# Altium project TIDA-010954-RevB.PrjPcb (part 4 of 6)

## Sheet TIDA-010954-ACSwitch.SchDoc
size 431 x 279 mm; Date: Not shown in title block; ApprovedBy: Not shown in title block; CheckedBy: Not shown in title block; Author: Not shown in title block; CompanyName: Not shown in title block; Engineer: Not shown in title block; Organization: Not shown in title block; Address1: Not shown in title block; Address2: Not shown in title block; Address3: Not shown in title block; Address4: Not shown in title block; DocumentNumber: 2; Revision: Use project parameter SCH_Rev; SheetNumber: 3; SheetTotal: 9; PageSetup: Record=PageOptions|CenterHorizontal=True|CenterVertical=True|PrintScale=1.00|XCorrection=1.00|YCorrection=1.00|PrintKind=0|BorderSize=5000000|LeftOffset=0|BottomOffset=0|Orientation=2|PaperLength=1000|PaperWidth=1000|Scale=100|PaperSource=15|PrintQuality=600|MediaType=1|DitherType=10|PaperKind=Letter|PrintScaleMode=1; CurrentTime: Not shown in title block; CurrentDate: Not shown in title block; Time: Not shown in title block; DocumentFullPathAndName: Not shown in title block; DocumentName: Not shown in title block; ModifiedDate: 1/25/2022; ImagePath: Not shown in title block
Used 2 times, as channels Cycloconverter/S1, Cycloconverter/S2. Parts and nets are listed once, with the designators drawn on the sheet.
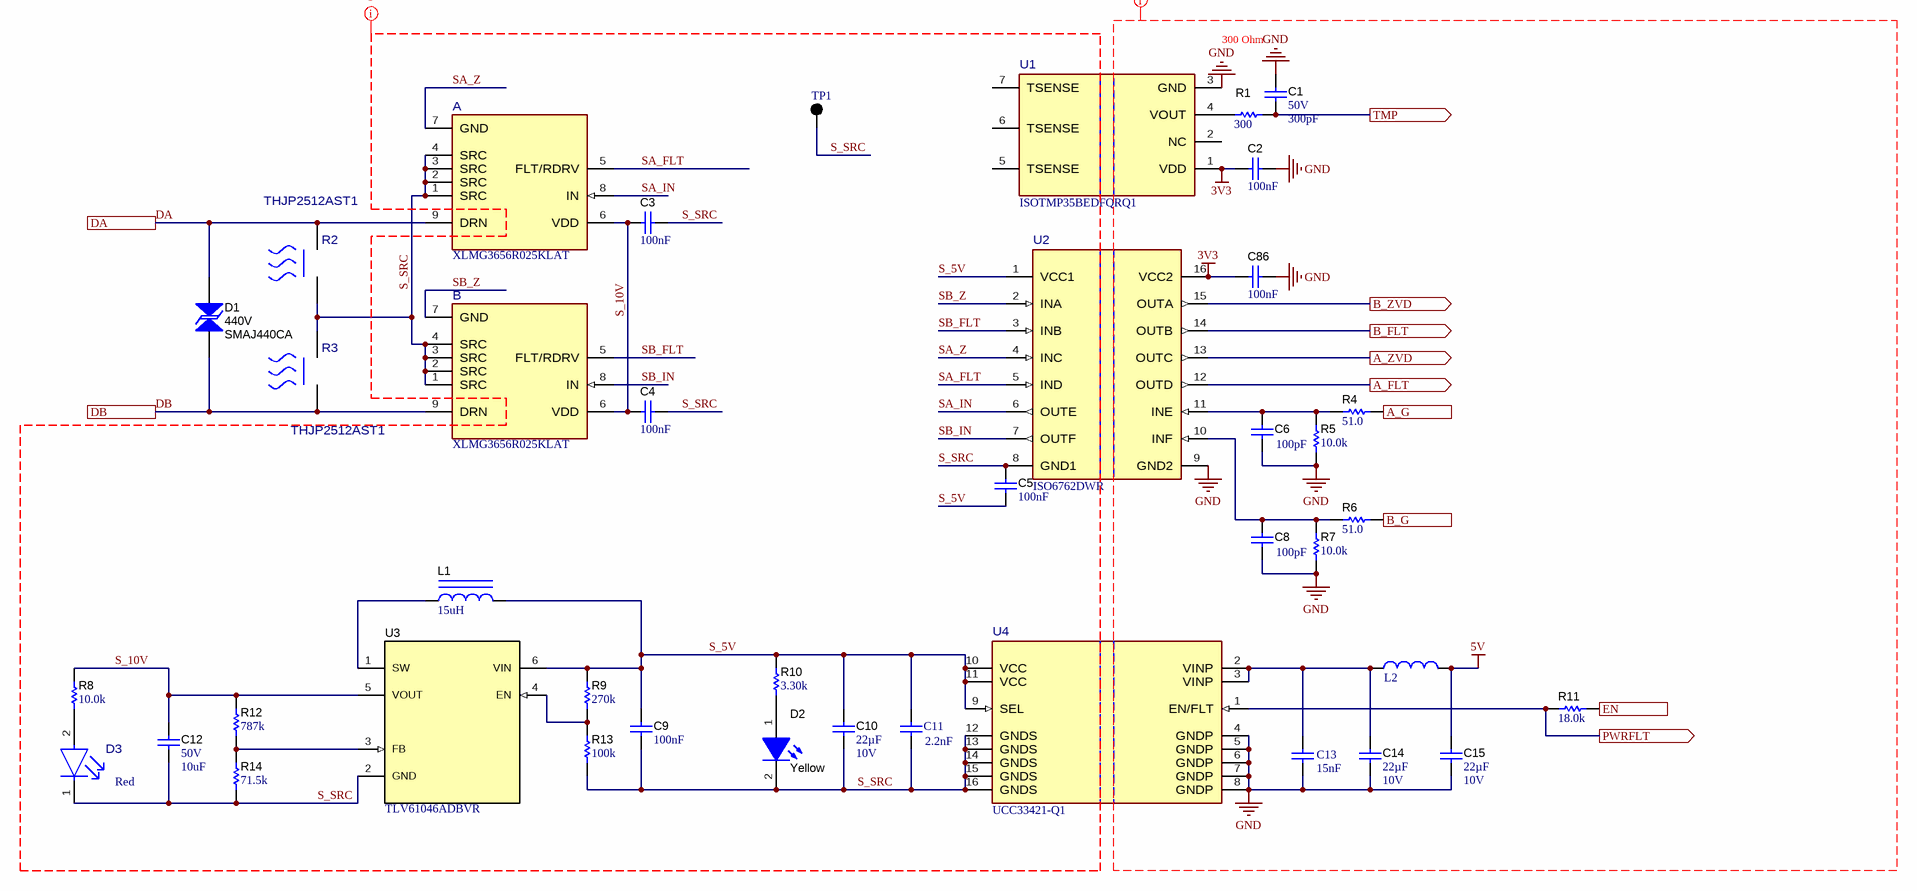
[diagram p5: TIDA-010954-ACSwitch.SchDoc]

### Parts
A  XLMG3656R025KLAT  [KLA0009A-MFG]
B  XLMG3656R025KLAT  [KLA0009A-MFG]
C1  VDC_V: 50V  ValueDisplayed: 300pF  [0603]  (hidden comment: GRM1885C1H301JA01D)
C2  Cap_F: 100nF  [0603]  (hidden comment: CGA3E2X7R1E104K080AA)
C3  Cap_F: 100nF  [0603]  (hidden comment: CGA3E2X7R1E104K080AA)
C4  Cap_F: 100nF  [0603]  (hidden comment: CGA3E2X7R1E104K080AA)
C5  Cap_F: 100nF  [0603]  (hidden comment: CGA3E2X7R1E104K080AA)
C6  ValueDisplayed: 100pF  [0603]  (hidden comment: GRM1885C1H101JA01D)
C8  ValueDisplayed: 100pF  [0603]  (hidden comment: GRM1885C1H101JA01D)
C9  Cap_F: 100nF  [0603]  (hidden comment: CGA3E2X7R1E104K080AA)
C10  Cap_F: 22µF  VDC_V: 10V  [0805_HV]  (hidden comment: GRM21BZ71A226ME15L)
C11  Cap_F: 2.2nF  [WCAP-CSGP_0402_L1W0.5H0.5]  (hidden comment: 885012205063)
C12  VDC_V: 50V  ValueDisplayed: 10uF  [1206_180]  (hidden comment: GRT31CR61H106KE01L)
C13  Cap_F: 15nF  [WCAP-CSGP_0402_L1W0.5H0.5]  (hidden comment: 885012205051)
C14  Cap_F: 22µF  VDC_V: 10V  [0805_HV]  (hidden comment: GRM21BZ71A226ME15L)
C15  Cap_F: 22µF  VDC_V: 10V  [0805_HV]  (hidden comment: GRM21BZ71A226ME15L)
C86  Cap_F: 100nF  [0603]  (hidden comment: CGA3E2X7R1E104K080AA)
D1  SMAJ440CA  value 440V  [SMA_Bi]
D2  value Yellow  [APT1608_Yellow]  (hidden comment: APT1608SYCK)
D3  Color: Red  [FP-APG1608SURKC_T_0603-MFG]  (hidden comment: APG1608SURKC/T)
L1  ValueDisplayed: 15uH  [SDR0302]  (hidden comment: SDR0302-150ML)
L2  74479763222  [WE-PMI_0603_L1.6W0.8H0.8]  (value not drawn)
R1  ValueDisplayed: 300  [0603]  (hidden comment: RC0603FR-07300RL)
R2  THJP2512AST1  [FP-THJP2512AST1_2512-MFG]
R3  THJP2512AST1  [FP-THJP2512AST1_2512-MFG]
R4  ValueDisplayed: 51.0  [0603]  (hidden comment: RC0603FR-0751RL)
R5  ValueDisplayed: 10.0k  [0603]  (hidden comment: RC0603FR-0710KL)
R6  ValueDisplayed: 51.0  [0603]  (hidden comment: RC0603FR-0751RL)
R7  ValueDisplayed: 10.0k  [0603]  (hidden comment: RC0603FR-0710KL)
R8  ValueDisplayed: 10.0k  [0603]  (hidden comment: RC0603FR-0710KL)
R9  ValueDisplayed: 270k  [0603]  (hidden comment: RC0603FR-07270KL)
R10  ValueDisplayed: 3.30k  [0603]  (hidden comment: RC0603FR-073K3L)
R11  ValueDisplayed: 18.0k  [0603]  (hidden comment: RC0603FR-0718KL)
R12  ValueDisplayed: 787k  [0603]  (hidden comment: RC0603FR-07787KL)
R13  ValueDisplayed: 100k  [0603]  (hidden comment: RC0603FR-07100KL)
R14  ValueDisplayed: 71.5k  [0603]  (hidden comment: RC0603FR-0771K5L)
TP1  5011  [Keystone5011]  (value not drawn)
U1  ISOTMP35BEDFQRQ1  [DFQ0007A-MFG]
U2  ISO6762DWR  [DW0016A-MFG]
U3  TLV61046ADBVR  [DBV0006A_N]
U4  UCC33421-Q1  [DWX0016A-MFG]

### Ports
A_FLT (out), A_G (in), A_ZVD (out), B_FLT (out), B_G (in), B_ZVD (out), DA, DB, EN (in), PWRFLT (out), TMP (out)

### Nets
3V3: C2.1 C86.1 U1.1(VDD) U2.16(VCC2)
5V: C15.1 L2.2
GND: C1.2 C2.2 C6.2 C8.2 C13.1 C14.2 C15.2 C86.2 R5.1 R7.1 U1.3(GND) U2.9(GND2) U4.4(GNDP) U4.5(GNDP) U4.6(GNDP) U4.7(GNDP) U4.8(GNDP)
A_FLT: U2.12(OUTD) ; port A_FLT
A_G: R4.2 ; port A_G
A_ZVD: U2.13(OUTC) ; port A_ZVD
B_FLT: U2.14(OUTB) ; port B_FLT
B_G: R6.2 ; port B_G
B_ZVD: U2.15(OUTA) ; port B_ZVD
DA: A.9(DRN) D1.2 R2.2 ; port DA
DB: B.9(DRN) D1.1 R3.1 ; port DB
EN: R11.2 ; port EN
PWRFLT: R11.1 U4.1(EN/FLT) ; port PWRFLT
S_5V: C5.1 C9.2 C10.1 C11.2 L1.2 R9.2 R10.2 U2.1(VCC1) U3.6(VIN) U4.9(SEL) U4.10(VCC) U4.11(VCC)
S_10V: A.6(VDD) B.6(VDD) C3.1 C4.1 C12.1 R8.2 R12.2 U3.5(VOUT)
S_SRC: A.1(SRC) A.2(SRC) A.3(SRC) A.4(SRC) B.1(SRC) B.2(SRC) B.3(SRC) B.4(SRC) C3.2 C4.2 C5.2 C9.1 C10.2 C11.1 C12.2 D2.2(K) D3.1(CATHODE) R2.1 R3.2 R13.1 R14.1 TP1.1 U2.8(GND1) U3.2(GND) U4.12(GNDS) U4.13(GNDS) U4.14(GNDS) U4.15(GNDS) U4.16(GNDS)
SA_FLT: A.5(FLT/RDRV) U2.5(IND)
SA_IN: A.8(IN) U2.6(OUTE)
SA_Z: A.7(GND) U2.4(INC)
SB_FLT: B.5(FLT/RDRV) U2.3(INB)
SB_IN: B.8(IN) U2.7(OUTF)
SB_Z: B.7(GND) U2.2(INA)
TMP: C1.1 R1.2 ; port TMP
NetC6_1: C6.1 R4.1 R5.2 U2.11(INE)
NetC8_1: C8.1 R6.1 R7.2 U2.10(INF)
NetC13_2: C13.2 C14.1 L2.1 U4.2(VINP) U4.3(VINP)
NetD2_1: D2.1(A) R10.1
NetD3_2: D3.2(ANODE) R8.1
NetL1_1: L1.1 U3.1(SW)
NetR1_1: R1.1 U1.4(VOUT)
NetR9_1: R9.1 R13.2 U3.4(EN)
NetR12_1: R12.1 R14.2 U3.3(FB)

Not connected (* = marked no-connect by the designer): U1 2(NC) 5(TSENSE) 6(TSENSE) 7(TSENSE)

### Channels
Cycloconverter/S1: designators A=S1A B=S1B C1=S1C1 C2=S1C2 C3=S1C3 C4=S1C4 C5=S1C5 C6=S1C6 C8=S1C8 C9=S1C9 C10=S1C10 C11=S1C11 C12=S1C12 C13=S1C13 C14=S1C14 C15=S1C15 C86=S1C86 D1=S1D1 D2=S1D2 D3=S1D3 L1=S1L1 L2=S1L2 R1=S1R1 R2=S1R2 R3=S1R3 R4=S1R4 R5=S1R5 R6=S1R6 R7=S1R7 R8=S1R8 R9=S1R9 R10=S1R10 R11=S1R11 R12=S1R12 R13=S1R13 R14=S1R14 TP1=S1TP1 U1=S1U1 U2=S1U2 U3=S1U3 U4=S1U4; ports A_FLT=S1A_FLT A_G=S1A_G A_ZVD=S1A_ZVD B_FLT=S1B_FLT B_G=S1B_G B_ZVD=S1B_ZVD DA=DA DB=DA EN=S_PWR PWRFLT=S1_PWR_FLT TMP=S1_TMP
Cycloconverter/S2: designators A=S2A B=S2B C1=S2C1 C2=S2C2 C3=S2C3 C4=S2C4 C5=S2C5 C6=S2C6 C8=S2C8 C9=S2C9 C10=S2C10 C11=S2C11 C12=S2C12 C13=S2C13 C14=S2C14 C15=S2C15 C86=S2C86 D1=S2D1 D2=S2D2 D3=S2D3 L1=S2L1 L2=S2L2 R1=S2R1 R2=S2R2 R3=S2R3 R4=S2R4 R5=S2R5 R6=S2R6 R7=S2R7 R8=S2R8 R9=S2R9 R10=S2R10 R11=S2R11 R12=S2R12 R13=S2R13 R14=S2R14 TP1=S2TP1 U1=S2U1 U2=S2U2 U3=S2U3 U4=S2U4; ports A_FLT=S2A_FLT A_G=S2A_G A_ZVD=S2A_ZVD B_FLT=S2B_FLT B_G=S2B_G B_ZVD=S2B_ZVD DA=DA DB=DB EN=S_PWR PWRFLT=S2_PWR_FLT TMP=S2_TMP

### Layout directives
net class SW_SRC: S_5V, S_10V, S_SRC, SA_FLT, SA_IN, SA_Z, SB_FLT, SB_IN, SB_Z
net class LV: 3V3, 5V, GND

### Notes on the sheet
- 300 Ohm
- Drawn By:
- SVN Rev:
- Number:
- TID #:
- Orderable:
- Rev:
- Sheet Title:
- File:
- Project Title:
- Designed for:
- Assembly Variant:
- Mod. Date:
- Sheet:
- Size:
- of
- B
- http://www.ti.com
- Texas Instruments and/or its licensors do not warrant the accuracy or completeness of this specification or any information contained therein. Texas Instruments and/or its licensors do not warrant that this design will meet the specifications, will be suitable for your application or fit for any particular purpose, or will operate in an implementation. Texas Instruments and/or its licensors do not warrant that the design is production worthy. You should completely validate and test your design implementation to confirm the system functionality for your application.
- Engineer:
- Contact:
- © Texas Instruments

### Library data of the parts
A B = CMP-0120607-2: Manufacturer: Texas Instruments; Part Number: LMG365x; SizeZ_mm: 2.35mm; AEC Qualified: No; Standoff Height: 0.1mm; AEC Category: Q200; CompType: IC; PackageReference: TO-9; PartNumber: XLMG3656R025KLAT; RoHS: UNKNOWN; Operating Temperature Range: to; Datasheet Path: datasheets/IC-LMG365x.pdf; helpURL: https://upverter.com/upn/revision/1f595fc64584fe9f/; ComponentLink1Description: Datasheet Link; ComponentLink1URL: http://www.ti.com/lit/ds/symlink/GPN.pdf; ComponentLink2Description: Product Folder; ComponentLink2URL: http://www.ti.com/product/GPN; ComponentLink3Description: Online Datasheet; ComponentLink3URL: http://www.ti.com/product/GPN/datasheet
C1 = CMP-0007206-4: as C16 on sheet TIDA-010954-Cycloconverter; Supplier Part Number 2: 81-GRM185C1H301JA01D; Publisher: Texas Instruments; Supplier 2: Mouser; TempCo: C0G/NP0; Published: 2008-06-19; RoHS: Y; MountType: SMT; Supplier 1: Digi-Key; PackageReference: 0603; Tolerance_%: 5%; Cap_Case: 0603; Value2: 50V; CompType: Capacitor; LatestRevisionDate: 2017-03-09; PartNumber: GRM1885C1H301JA01D; AEC Qualified: ?; Cap_F: 300pF; ComponentLink1Description: Datasheet link; Supplier Part Number 1: 490-1438-1-ND; Technology: Ceramic; ComponentLink1URL: http://search.murata.co.jp/Ceramy/PnsearchViewAction.do?HnOFG=ON&HnNFG=ON&SEL_CNT=50&sLang=en&sKey=GRM1885C1H301JA01D&x=9&y=9&search=startwith
C2-C5 C9 C86 = CMP-0007077-5: CAP, CERM, 0.1 uF, 25 V, +/- 10%, X7R, AEC-Q200 Grade 1, 0603; Manufacturer: TDK; TaMin_C: -55°C; Polarized: N; SizeAreaWB_mm2: 4.68; Value1: Unknown; U/M: EA; Value: 0.1uF; TaMax_C: 125°C; SizeZ_mm: 1; SizeX_mm: 1.6; SizeY_mm: 0.8; Value2: 25V; SizeArea_mm2: 1.28; AEC Qualified: Y; AEC Category: Q200; Supplier Part Number 2: 79Y4100; Publisher: Texas Instruments; Supplier 2: Newark; Supplier Part Number 3: 810-CGA3E2X7R1E104K; TempCo: X7R; Supplier 3: Mouser; Published: 2008-06-19; RoHS: Y; MountType: SMT; Supplier 1: Digi-Key; PackageReference: 0603; Tolerance_%: 10%; Cap_Case: 0603; CompType: Capacitor; LatestRevisionDate: 2017-03-09; PartNumber: CGA3E2X7R1E104K080AA; VDC_V: 25V; ComponentLink1Description: Datasheet link; AEC Grade: 1; Supplier Part Number 1: 445-5667-1-ND; Technology: Ceramic; ValueDisplayed: 0.1uF; ComponentLink1URL: https://product.tdk.com/info/en/documents/chara_sheet/CGA3E2X7R1E104K080AA.pdf
C6 C8 = CMP-0007171-4: CAP, CERM, 100 pF, 50 V, +/- 5%, C0G/NP0, 0603; Manufacturer: MuRata; TaMin_C: -55°C; Polarized: N; SizeAreaWB_mm2: 4.68; Value1: Unknown; U/M: EA; Value: 100pF; TaMax_C: 125°C; SizeZ_mm: 1; SizeX_mm: 1.6; SizeY_mm: 0.8; Value2: 50V; SizeArea_mm2: 1.28; AEC Category: Q200; Supplier Part Number 2: 81-GRM39C101J50; Publisher: Texas Instruments; Supplier 2: Mouser; Supplier Part Number 3: 8819866; TempCo: C0G/NP0; Supplier 3: Farnell; Published: 2008-06-19; RoHS: Y; MountType: SMT; Supplier 1: Digi-Key; PackageReference: 0603; Tolerance_%: 5%; Cap_Case: 0603; CompType: Capacitor; LatestRevisionDate: 2017-03-09; PartNumber: GRM1885C1H101JA01D; AEC Qualified: ?; Cap_F: 100pF; VDC_V: 50V; ComponentLink1Description: Datasheet link; Supplier Part Number 1: 490-1427-1-ND; Technology: Ceramic; ComponentLink1URL: http://search.murata.co.jp/Ceramy/PnsearchViewAction.do?HnOFG=ON&HnNFG=ON&SEL_CNT=50&sLang=en&sKey=GRM1885C1H101JA01D&x=9&y=9&search=startwith
C10 C14 C15 = CMP-0008377-2: CAP, CERM, 22 uF, 10 V, +/- 20%, X7R, 0805; Manufacturer: MuRata; SizeY_mm: 1.25; Cap_Case: 0805; SizeArea_mm2: 2.5; AEC Qualified: N; AEC Category: Q200; ValueDisplayed: 22uF; TaMin_C: -55°C; SizeAreaWB_mm2: 6.75; Value1: Unknown; U/M: EA; Value: 22uF; TaMax_C: 125°C; SizeZ_mm: 1.45; SizeX_mm: 2; Value2: 10V; CompType: Capacitor; LatestRevisionDate: 2017-03-09; PartNumber: GRM21BZ71A226ME15L; ComponentLink1Description: Datasheet link; AEC Grade: N/A; Supplier Part Number 1: 81-GRM21BZ71A226ME5L; Technology: Ceramic; ComponentLink1URL: http://psearch.en.murata.com/capacitor/product/GRM21BZ71A226ME15%23.pdf; Publisher: Texas Instruments; Polarized: N; TempCo: X7R; Published: 2008-06-19; RoHS: Y; MountType: SMT; Supplier 1: Mouser; PackageReference: 0805; Tolerance_%: 20%
C11 = CMP-0119293-1: WCAP-CSGP Multilayer Ceramic Chip Capacitor, General Purpose, size 0402, X7R, 2.2nF, 50VDC; Manufacturer: Wurth Elektronik; Capacitance Tolerance: +/-10%; Case/Size Code: 0402; Dissipation Factor: 2.5%; Insulation Resistance: 10GOhm; Rated Voltage (DC): 50V; Technical Reference: X7R0402222K050DFCT10000; Design Item ID: 885012205063; Category: Multilayer Ceramic Chip Capacitors; Ceramic Type: X7R; Component Type: Standard; Height: 0.5mm; Length: 1mm; Manufacturer Part Number: 885012205063; Match Code: WCAP-CSGP; Mount: Surface Mount; Operating Temperature Max: 125°C; Operating Temperature Min: -55°C; Packaging: Tape and Reel; Pin Count: 2; Source: MLCC Capacitors.SchLib; Width: 0.5mm; ComponentLink1Description: Website Link; ComponentLink1URL: https://www.we-online.com/redexpert/article/885012205063?ad; ComponentLink2Description: Datasheet Link; ComponentLink2URL: https://www.we-online.com/redexpert/spec/885012205063?ad; PartNumber: 885012205063
C12 = CMP-0009015-2: CAP, CERM, 10 uF, 50 V, +/- 10%, X5R, AEC-Q200 Grade 1, 1206; Manufacturer: MuRata; TaMin_C: -55°C; Polarized: N; SizeAreaWB_mm2: 10.92; Value1: Unknown; U/M: EA; Value: 10uF; TaMax_C: 85°C; SizeZ_mm: 1.8; SizeX_mm: 3.2; SizeY_mm: 1.6; Cap_Case: 1206; SizeArea_mm2: 5.12; AEC Qualified: Y; Cap_F: 10µF; AEC Grade: 1; AEC Category: Q200; Publisher: Texas Instruments; Supplier 2: Newark; Supplier Part Number 3: 81-GRT31CR61H106KE1L; TempCo: X5R; Supplier 3: Mouser; Published: 2008-06-19; RoHS: Y; MountType: SMT; Supplier 1: Digi-Key; PackageReference: 1206; Tolerance_%: 10%; Value2: 50V; CompType: Capacitor; LatestRevisionDate: 2017-03-09; PartNumber: GRT31CR61H106KE01L; ComponentLink1Description: Datasheet link; Supplier Part Number 1: 490-12456-1-ND; Technology: Ceramic; ComponentLink1URL: http://search.murata.co.jp/Ceramy/image/img/A01X/G101/ENG/GRT31CR61H106KE01-01.pdf
C13 = CMP-0115362-1: WCAP-CSGP Multilayer Ceramic Chip Capacitor, General Purpose, size 0402, X7R, 15nF, 25VDC; Manufacturer: Wurth Elektronik; Capacitance Tolerance: +/-10%; Case/Size Code: 0402; Dissipation Factor: 3.5%; Insulation Resistance: 10GOhm; Rated Voltage (DC): 25V; Technical Reference: X7R0402153K025DFCT10000; Design Item ID: 885012205051; Category: Multilayer Ceramic Chip Capacitors; Ceramic Type: X7R; Height: 0.5mm; Length: 1mm; Manufacturer Part Number: 885012205051; Match Code: WCAP-CSGP; Mount: Surface Mount; Operating Temperature Max: 125°C; Operating Temperature Min: -55°C; Packaging: Tape and Reel; Source: Capacitors.SchLib; Width: 0.5mm; ComponentLink1Description: Website Link; ComponentLink1URL: https://www.we-online.com/redexpert/article/885012205051?ad; ComponentLink2Description: Datasheet Link; ComponentLink2URL: https://www.we-online.com/redexpert/spec/885012205051?ad; PartNumber: 885012205051
D1 = CMP-0085046-1: Diode, TVS, Bi, 440 V, 713 Vc, 400 W, 0.6 A, SMA (non-polarized); Manufacturer: Littelfuse; Vbr_Max: 543V; Vbr_Min: 492V; Ppk: 400W; SizeY_mm: 2.575; Value1: 713V; SizeArea_mm2: 13.068125; SizeX_mm: 5.075; AEC Category: Q101; SizeAreaWB_mm2: 32.368125; SizeZ_mm: 2.65; RJA_CperW: 120; Ipp: 600mA; AEC Qualified: N; PackageReference: SMA (non-polarized); ComponentLink1URL: https://www.littelfuse.com/~/media/electronics/datasheets/tvs_diodes/littelfuse_tvs_diode_smaj_datasheet.pdf.pdf; PartNumber: SMAJ440CA; MountType: SMT; CompType: TVS; Vc: 713V; VRWM: 440V; ComponentLink1Description: Datasheet link; RoHS: Y
D2 = CMP-0002944-3: LED, Yellow, SMD; Manufacturer: Kingbright; Value2: 2.5V; Ir_A: 10µA; Tjmax_C: 85°C; Value1: W; Io_A: 20mA; Vr_V: 5V; Angle: 120; Color: yellow; CompType: LED; MountType: SMT; RoHS: Y; ComponentLink1URL: http://www.kingbrightusa.com/images/catalog/SPEC/APT1608SYCK.pdf; Type: ?; PackageReference: 0603(1608); ComponentLink1Description: Datasheet link; Vf_V: 2.5V; PartNumber: APT1608SYCK
D3 = CMP-0091305-2: Red 630nm LED Indication - Discrete 2V 0603 (1608 Metric); Manufacturer: Kingbright; AEC Qualified: No; Import Ts: 1521847491; Forward Current: 20mA; Vr_V: 5V; Ciiva Ids: 1546259; Luminous Intensity: 110mcd; Power_TotalModule: 75mW; Tjmax_C: 115°C; Led Orientation: Top View; SizeZ_mm: 0.28mm; LambdaP: 645nm; Angle: 120°; ComponentLink1Description: Datasheet; PackageReference: 0603; Release Date: 1390185805; Mouser Part Number: 604-APG1608SURKC/T; PartNumber: APG1608SURKC/T; Digikey Part Number: 754-1359-1-ND; Mouser Description: APG1608SURKC/T Red LED, 630 nm 1608 (0603) Clear, Rectangle Lens SMD package; RoHS: TRUE; LambdaD: 630nm; Lead Free: Yes; Vf_V: 2V; Part Number: APG1608SURKC/T; ComponentLink1URL: https://www.kingbrightusa.com/images/catalog/SPEC/APG1608SURKC-T.pdf; helpURL: https://upverter.com/upn/revision/2eb98c3e10735b4d/; datasheet: https://www.kingbrightusa.com/images/catalog/SPEC/APG1608SURKC-T.pdf; Digikey Description: LED RED CLEAR CHIP SMD; Operating Temperature Range: -40°C to +85°C; Datasheet Path: datasheets/Diode-APG1608SURKC_T.pdf; Vault Guid: 951D1CBD-CFDD-403F-A235-A7AC0CBD640F
L1 = CMP-0057419-2: Inductor, Drum Core, Ferrite, 15 uH, 0.65 A, 0.4 ohm, SMD; Manufacturer: Bourns; Isat: 0.86A @ 10% inductance drop; Irms: 0.65A @ 40C rise; Green_Lifecycle: Active; SizeAreaWB_mm2: 15.2; DCR_ohm: 4d; Green_REACh: Passed; Value1: 0.4 ohm; Value: 15uH; Imax_A: 6.5dA; SizeZ_mm: 2.5; SizeX_mm: 3; SizeY_mm: 2.8; Value2: 0.65A; SizeArea_mm2: 8.4; Ind_H: 15µH; AEC Category: Q200; Supplier Part Number 2: 652-SDR0302-150ML; Publisher: Texas Instruments; Supplier 2: Mouser; Supplier Part Number 3: 1682358; Supplier 3: Farnell; Published: 2008-06-26; RoHS: Y; Material: Ferrite; MountType: SMT; Green_EU RoHS-2: Incomplete; Supplier 1: Digi-Key; Green_EU RoHS: Passed; PackageReference: 3x2.5x2.8mm; CompType: Inductor; LatestRevisionDate: 2017-06-02; PartNumber: SDR0302-150ML; AEC Qualified: ?; ComponentLink1Description: Datasheet link; Supplier Part Number 1: SDR0302-150MLCT-ND; Technology: Drum Core; ComponentLink1URL: http://www.bourns.com/data/global/pdfs/SDR0302.pdf
L2 = CMP-0100992-1: WE-PMI SMT Power Multilayer Inductor, size 0603, 2.2uH, 0.8A, 375mOhm; Manufacturer: Wurth Elektronik; Case/Size Code: 0603; Inductance Tolerance: 20%; Q Factor: 15; Saturation Current: 0.28A; Self Resonant Frequency: 80MHz; Type: Low RDC; Design Item ID: 74479763222; Category: Power Inductors; Component Type: Standard; DC Resistance: 375mOhm; Height: 0.8mm; Inductance: 2.2uH; Length: 1.6mm; Manufacturer Part Number: 74479763222; Match Code: WE-PMI; Mount: Surface Mount; Operating Temperature Max: 125°C; Operating Temperature Min: -40°C; Packaging: Tape and Reel; Pin Count: 2; Rated Current: 0.8A; Source: Inductors.SchLib; Width: 0.8mm; ComponentLink1Description: Website Link; ComponentLink1URL: https://www.we-online.com/redexpert/article/74479763222?ad; ComponentLink2Description: Datasheet Link; ComponentLink2URL: https://www.we-online.com/redexpert/spec/74479763222?ad; PartNumber: 74479763222
R1 = CMP-0023013-5: as R36 on sheet TIDA-010954-Cycloconverter; Supplier Part Number 2: 603-RC0603FR-07300RL; Supplier 2: Mouser; Supplier Part Number 3: 1799340; Supplier 3: Farnell; RoHS: Y; Value1: 1%; MountType: SMT; Supplier 1: Digi-Key; PackageReference: 0603; Tolerance_%: 1%; Res_ohm: 300; CompType: Resistor; PartNumber: RC0603FR-07300RL; ComponentLink1Description: Datasheet link; Supplier Part Number 1: 311-300HRCT-ND; Technology: Thick Film; ComponentLink1URL: http://www.yageo.com/pdf/Pu-RC0603_51_PbFree_L_2.pdf; AEC Grade: N/A
R2 R3 = CMP-0122927-1: Thermal Pad 6.40mm x 3.20mm Rectangular; Manufacturer: Vishay; AEC Grade: Grade 0; AEC Qualified: Yes; SizeZ_mm: 0.035inch; PackageReference: 2512; PartNumber: THJP2512AST1; RoHS: TRUE; Supplier 1: Digikey; Supplier 2: Mouser; Supplier Part Number 1: 764-THJP2512AST1CT-ND; Supplier Part Number 2: 71-THJP2512AST1; Part Number: THJP2512AST1; datasheet: https://www.vishay.com/docs/60157/thjp.pdf; Datasheet Path: datasheets/Res-THJP2512AST1.pdf; Digikey Description: THERMAL JUMPER 2512 30 MIL LEAD-; Digikey Part Number: 764-THJP2512AST1CT-ND; helpURL: https://upverter.com/upn/revision/ceaa2e8b1f06c0a2/; Lead Free: Yes; Mouser Description: THERMAL JUMPER 2512 30 MIL LEAD, wraparound Sn (e3) solder; Mouser Part Number: 71-THJP2512AST1; Operating Temperature Range: -65°C to +150°C; ComponentLink1Description: Datasheet; ComponentLink1URL: https://www.vishay.com/docs/60157/thjp.pdf
R4 R6 = CMP-0023169-5: RES, 51.0, 1%, 0.1 W, 0603; Manufacturer: Yageo; Power_W: 100mW; TempCo: 100 ppm/C; Value_Code: 51R0; Value: 51.0; Res_ohm: 51; SizeX_mm: 1.6; SizeY_mm: 0.8; SizeZ_mm: 1; Value2: 0.1W; SizeArea_mm2: 1.28; AEC Qualified: N; VDC_V: 75V; AEC Category: Q200; SizeAreaWB_mm2: 4.68; Supplier Part Number 2: 603-RC0603FR-0751RL; Supplier 2: Mouser; Supplier Part Number 3: 1799350; Supplier 3: Farnell; RoHS: Y; Value1: 1%; Supplier 1: Digi-Key; PackageReference: 0603; Tolerance_%: 1%; CompType: Resistor; PartNumber: RC0603FR-0751RL; ComponentLink1Description: Datasheet link; Supplier Part Number 1: 311-51.0HRCT-ND; Technology: Thick Film; MountType: SMT; ComponentLink1URL: http://www.yageo.com/pdf/Pu-RC0603_51_PbFree_L_2.pdf; AEC Grade: N/A
R5 R7 R8 = CMP-0022746-5: RES, 10.0 k, 1%, 0.1 W, 0603; Manufacturer: Yageo; Power_W: 100mW; TempCo: 100 ppm/C; Value_Code: 10k0; Value: 10.0k; EIA_Code: E96; Res_ohm: 10k; SizeX_mm: 1.6; SizeY_mm: 0.8; SizeZ_mm: 1; Value2: 0.1W; SizeArea_mm2: 1.28; AEC Qualified: N; VDC_V: 75V; AEC Category: Q200; SizeAreaWB_mm2: 4.68; Supplier Part Number 2: 603-RC0603FR-0710KL; Supplier 2: Mouser; Supplier Part Number 3: 9238603; Supplier 3: Farnell; RoHS: Y; Value1: 1%; MountType: SMT; Supplier 1: Digi-Key; PackageReference: 0603; Tolerance_%: 1%; CompType: Resistor; PartNumber: RC0603FR-0710KL; ComponentLink1Description: Datasheet link; Supplier Part Number 1: 311-10.0KHRCT-ND; Technology: Thick Film; ComponentLink1URL: http://www.yageo.com/pdf/Pu-RC0603_51_PbFree_L_2.pdf; AEC Grade: N/A
R9 = CMP-0022961-4: RES, 270 k, 1%, 0.1 W, 0603; Manufacturer: Yageo; Power_W: 100mW; TempCo: 100 ppm/C; Value: 270k; SizeX_mm: 1.6; SizeY_mm: 0.8; SizeZ_mm: 1; Value2: 0.1W; SizeArea_mm2: 1.28; AEC Qualified: N; VDC_V: 75V; AEC Category: Q200; SizeAreaWB_mm2: 4.68; ComponentLink1URL: http://www.yageo.com/pdf/Pu-RC0603_51_PbFree_L_2.pdf; Supplier Part Number 2: 603-RC0603FR-07270KL; Supplier 2: Mouser; Supplier Part Number 3: 9238778; Supplier 3: Farnell; Value_Code: 270k; RoHS: Y; Value1: 1%; MountType: SMT; Supplier 1: Digi-Key; PackageReference: 0603; Tolerance_%: 1%; Res_ohm: 270k; CompType: Resistor; PartNumber: RC0603FR-07270KL; ComponentLink1Description: Datasheet link; Supplier Part Number 1: 311-270KHRCT-ND; Technology: Thick Film; AEC Grade: N/A
R10 = CMP-0023081-5: RES, 3.30 k, 1%, 0.1 W, 0603; Manufacturer: Yageo; Power_W: 100mW; TempCo: 100 ppm/C; Value_Code: 3k30; Value: 3.30k; Res_ohm: 3.3k; SizeX_mm: 1.6; SizeY_mm: 0.8; SizeZ_mm: 1; Value2: 0.1W; SizeArea_mm2: 1.28; AEC Qualified: N; VDC_V: 75V; AEC Category: Q200; SizeAreaWB_mm2: 4.68; Supplier Part Number 2: 603-RC0603FR-073K3L; Supplier 2: Mouser; Supplier Part Number 3: 9238549; Supplier 3: Farnell; RoHS: Y; Value1: 1%; MountType: SMT; Supplier 1: Digi-Key; PackageReference: 0603; Tolerance_%: 1%; CompType: Resistor; PartNumber: RC0603FR-073K3L; ComponentLink1Description: Datasheet link; Supplier Part Number 1: 311-3.30KHRCT-ND; Technology: Thick Film; ComponentLink1URL: http://www.yageo.com/pdf/Pu-RC0603_51_PbFree_L_2.pdf; AEC Grade: N/A
R11 = CMP-0022852-5: RES, 18.0 k, 1%, 0.1 W, 0603; Manufacturer: Yageo; Power_W: 100mW; TempCo: 100 ppm/C; Value_Code: 18k0; Value: 18.0k; Res_ohm: 18k; SizeX_mm: 1.6; SizeY_mm: 0.8; SizeZ_mm: 1; Value2: 0.1W; SizeArea_mm2: 1.28; AEC Qualified: N; VDC_V: 75V; AEC Category: Q200; SizeAreaWB_mm2: 4.68; Supplier Part Number 2: 603-RC0603FR-0718KL; Supplier 2: Mouser; Supplier Part Number 3: 9238638; Supplier 3: Farnell; RoHS: Y; Value1: 1%; MountType: SMT; Supplier 1: Digi-Key; PackageReference: 0603; Tolerance_%: 1%; CompType: Resistor; PartNumber: RC0603FR-0718KL; ComponentLink1Description: Datasheet link; Supplier Part Number 1: 311-18.0KHRCT-ND; Technology: Thick Film; ComponentLink1URL: http://www.yageo.com/pdf/Pu-RC0603_51_PbFree_L_2.pdf; AEC Grade: N/A
R12 = CMP-0023273-4: RES, 787 k, 1%, 0.1 W, 0603; Manufacturer: Yageo; Power_W: 100mW; TempCo: 100 ppm/C; Value: 787k; EIA_Code: E96; SizeX_mm: 1.6; SizeY_mm: 0.8; SizeZ_mm: 1; Value2: 0.1W; SizeArea_mm2: 1.28; AEC Qualified: N; VDC_V: 75V; AEC Category: Q200; SizeAreaWB_mm2: 4.68; ComponentLink1URL: http://www.yageo.com/pdf/Pu-RC0603_51_PbFree_L_2.pdf; Supplier Part Number 2: 603-RC0603FR-07787KL; Supplier 2: Mouser; Value_Code: 787k; RoHS: Y; Value1: 1%; MountType: SMT; Supplier 1: Digi-Key; PackageReference: 0603; Tolerance_%: 1%; Res_ohm: 787k; CompType: Resistor; PartNumber: RC0603FR-07787KL; ComponentLink1Description: Datasheet link; Supplier Part Number 1: 311-787KHRCT-ND; Technology: Thick Film; AEC Grade: N/A
R13 = CMP-0022735-5: RES, 100 k, 1%, 0.1 W, 0603; Manufacturer: Yageo; Power_W: 100mW; TempCo: 100 ppm/C; Value: 100k; EIA_Code: E96; SizeX_mm: 1.6; SizeY_mm: 0.8; SizeZ_mm: 1; Value2: 0.1W; SizeArea_mm2: 1.28; AEC Qualified: N; VDC_V: 75V; AEC Category: Q200; SizeAreaWB_mm2: 4.68; Supplier Part Number 2: 603-RC0603FR-07100KL; Supplier 2: Mouser; Supplier Part Number 3: 9238727; Supplier 3: Farnell; Value_Code: 100k; RoHS: Y; Value1: 1%; MountType: SMT; Supplier 1: Digi-Key; PackageReference: 0603; Tolerance_%: 1%; Res_ohm: 100k; CompType: Resistor; PartNumber: RC0603FR-07100KL; ComponentLink1Description: Datasheet link; Supplier Part Number 1: 311-100KHRCT-ND; Technology: Thick Film; ComponentLink1URL: http://www.yageo.com/pdf/Pu-RC0603_51_PbFree_L_2.pdf; AEC Grade: N/A
R14 = CMP-0023259-5: RES, 71.5 k, 1%, 0.1 W, 0603; Manufacturer: Yageo; Power_W: 100mW; TempCo: 100 ppm/C; Value_Code: 71k5; Value: 71.5k; EIA_Code: E96; SizeX_mm: 1.6; SizeY_mm: 0.8; SizeZ_mm: 1; Value2: 0.1W; SizeArea_mm2: 1.28; AEC Qualified: N; VDC_V: 75V; AEC Category: Q200; SizeAreaWB_mm2: 4.68; Supplier Part Number 2: 603-RC0603FR-0771K5L; Supplier 2: Mouser; RoHS: Y; Value1: 1%; MountType: SMT; Supplier 1: Digi-Key; PackageReference: 0603; Tolerance_%: 1%; Res_ohm: 71.5k; CompType: Resistor; PartNumber: RC0603FR-0771K5L; ComponentLink1Description: Datasheet link; Supplier Part Number 1: 311-71.5KHRCT-ND; Technology: Thick Film; ComponentLink1URL: http://www.yageo.com/pdf/Pu-RC0603_51_PbFree_L_2.pdf; AEC Grade: N/A
TP1 = CMP-0055148-2: as TP8-TP10 on sheet TIDA-010954-Cycloconverter; ComponentLink1Description: Datasheet URL; Supplier 1: Digi-Key; MountType: TH; Supplier 2: Mouser; LatestRevisionDate: 26/05/2017; Publisher: Texas Instruments; PartNumber: 5011; Color: Black; ComponentLink1URL: http://www.keyelco.com/userAssets/file/M60-2p60.pdf; Green_EU RoHS-2: Incomplete; Supplier Part Number 1: 36-5011-ND; Supplier Part Number 2: 534-5011; Green_EU RoHS: Passed; RoHS: Y; PackageReference: Black Multipurpose Testpoint; CompType: Test Point
U1 = CMP-0122473-1: Automotive ±1.5°C, 3-kVRMS Isolated Temperature Sensor With Analog Output With < 2 Seconds Response Time and 500VRMS Working Voltage; Manufacturer: Texas Instruments; SizeZ_mm: 1.75mm; AEC Qualified: Yes; AEC Grade: Grade 0; Max Supply Voltage: 5.5V; Min Supply Voltage: 2.3V; Operating Supply Current: 10uA; Sensor Output: Analog Voltage; Standoff Height: 0.11mm; TaMax_C: +150°C; TaMin_C: -40°C; TJmax_C: +155°C; PackageReference: SOIC7; PartNumber: ISOTMP35BEDFQRQ1; RoHS: UNKNOWN; Operating Temperature Range: -40°C to +150°C; Part Number: ISOTMP35BEDFQRQ1; Datasheet Path: datasheets/IC-ISOTMP35BEDFQRQ1.pdf; helpURL: https://upverter.com/upn/revision/9d6633f19cb3a875/
U2 = CMP-0096105-1: General purpose, 50-Mbps, six-channel (4/2) digital isolator 16-SOIC -40 to 125; Manufacturer: Texas Instruments; Min Supply Voltage: 1.71V; TJmax_C: +150°C; TaMax_C: +125°C; AEC Qualified: No; Max Supply Voltage: 5.5V; Standoff Height: 0.1mm; SizeZ_mm: 2.65mm; Interface: SPI,UART,CAN,RS-232,RS-485; TaMin_C: -40°C; Operating Temperature Range: -40°C to +125°C; ComponentLink1Description: Datasheet; Lead Free: Yes; RoHS: TRUE; Digikey Part Number: 296-ISO6762DWRCT-ND; ComponentLink1URL: https://www.ti.com/lit/ds/symlink/iso6762.pdf; PartNumber: ISO6762DWR; Part Number: ISO6762DWR; Datasheet Path: datasheets/IC-ISO6762DWR.pdf; Digikey Description: GENERAL PURPOSE, 50-MBPS, SIX-CH; helpURL: https://upverter.com/upn/revision/21f4622b36668d4f/; datasheet: https://www.ti.com/lit/ds/symlink/iso6762.pdf; PackageReference: SOIC16; Mouser Part Number: 595-ISO6762DWR
U3 = CMP-0013231-2: 28-V Output Voltage Boost Converter with Power Diode and Isolation Switch, DBV0006A (SOT-6); Manufacturer: Texas Instruments; Alternate PartNumber: TLV61046ADBVT; SizeX_mm: 2.8; SizeY_mm: 2.9; CompType: IC; SizeZ_mm: 1.45; SizeArea_mm2: 8.12; SizeAreaWB_mm2: 14.82; U/M: EA; PackageDescription: SOT-6; PartNumber: TLV61046ADBVR; ComponentLink1URL: https://sps06.itg.ti.com/sites/KMS/crossdivteams/altium/docs/ComponentDatasheets/TLV61046A 2017-2-3.pdf; ComponentLink1Description: Datasheet Link; LatestRevisionDate: 2017-03-09; Publisher: Texas Instruments; PackageReference: DBV0006A; MountType: SMT; Alternate Manufacturer: Texas Instruments
U4 = CMP-0120108-2: 1.5W, High-Density, >5 kVRMS Isolated DC-DC Converter; Manufacturer: Texas Instruments; SizeZ_mm: 2.6mm; AEC Qualified: No; Max Supply Voltage: 5.5V; Min Supply Voltage: 4.5V; Number Of Outputs: 1; Output Type: AdjustableProgrammable; Output Voltage: 5/5.5V; Standoff Height: 0.14mm; AEC Category: Q200; CompType: IC; PackageReference: SSOP16; PartNumber: UCC33421-Q1; RoHS: UNKNOWN; Operating Temperature Range: -40°C to +125°C; Part Number: UCC33421-Q1; Datasheet Path: datasheets/IC-UCC33421-Q1.pdf; helpURL: https://upverter.com/upn/revision/b421b141291ae359/; ComponentLink1Description: Datasheet Link; ComponentLink1URL: http://www.ti.com/lit/ds/symlink/GPN.pdf; ComponentLink2Description: Product Folder; ComponentLink2URL: http://www.ti.com/product/GPN; ComponentLink3Description: Online Datasheet; ComponentLink3URL: http://www.ti.com/product/GPN/datasheet

## Sheet TIDA-010954-FullBridge.SchDoc
size 431 x 279 mm; Date: Not shown in title block; ApprovedBy: Not shown in title block; CheckedBy: Not shown in title block; Author: Not shown in title block; CompanyName: Not shown in title block; Engineer: Not shown in title block; Organization: Not shown in title block; Address1: Not shown in title block; Address2: Not shown in title block; Address3: Not shown in title block; Address4: Not shown in title block; DocumentNumber: 2; Revision: Use project parameter SCH_Rev; SheetNumber: 4; SheetTotal: 9; PageSetup: Record=PageOptions|CenterHorizontal=True|CenterVertical=True|PrintScale=1.00|XCorrection=1.00|YCorrection=1.00|PrintKind=0|BorderSize=5000000|LeftOffset=0|BottomOffset=0|Orientation=2|PaperLength=1000|PaperWidth=1000|Scale=100|PaperSource=15|PrintQuality=600|MediaType=1|DitherType=10|PaperKind=Letter|PrintScaleMode=1; CurrentTime: Not shown in title block; CurrentDate: Not shown in title block; Time: Not shown in title block; DocumentFullPathAndName: Not shown in title block; DocumentName: Not shown in title block; ModifiedDate: 1/25/2022; ImagePath: Not shown in title block
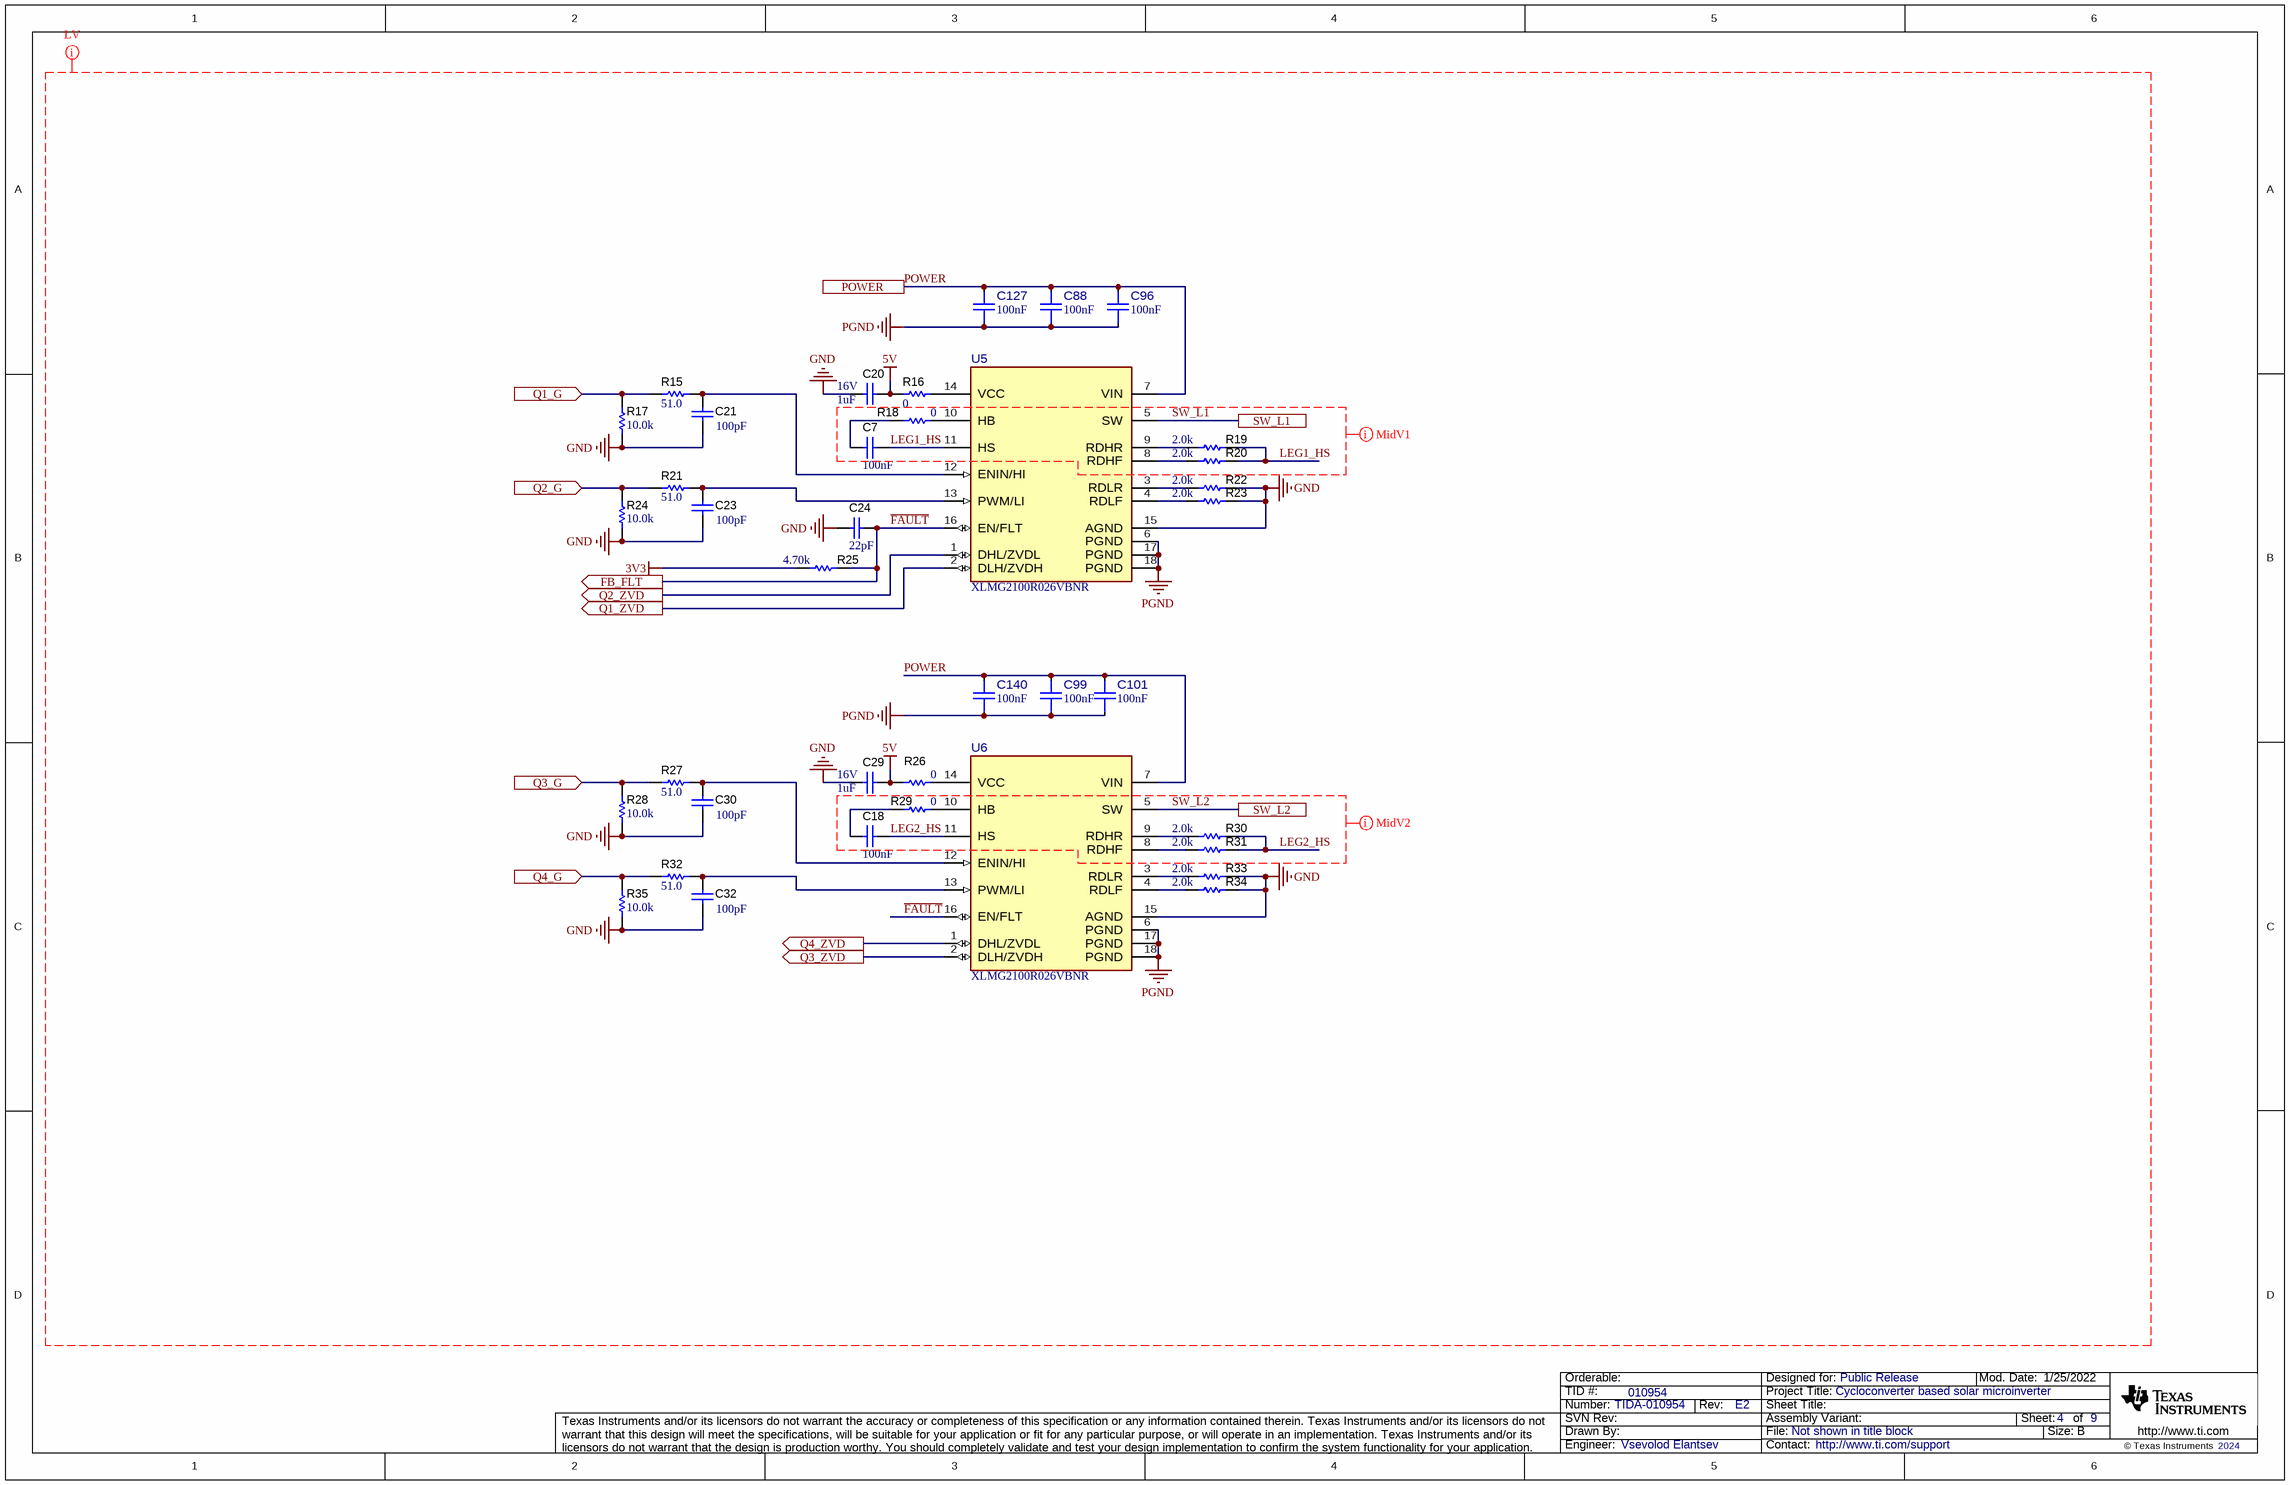
[diagram p6: TIDA-010954-FullBridge.SchDoc]

### Parts
C7  Cap_F: 100nF  [0603]  (hidden comment: CGA3E2X7R1E104K080AA)
C18  Cap_F: 100nF  [0603]  (hidden comment: CGA3E2X7R1E104K080AA)
C20  VDC_V: 16V  ValueDisplayed: 1uF  [0603]  (hidden comment: GRM185R61C105KE44D)
C21  ValueDisplayed: 100pF  [0603]  (hidden comment: GRM1885C1H101JA01D)
C23  ValueDisplayed: 100pF  [0603]  (hidden comment: GRM1885C1H101JA01D)
C24  ValueDisplayed: 22pF  [0603]  (hidden comment: GRM1885C1H220JA01D)
C29  VDC_V: 16V  ValueDisplayed: 1uF  [0603]  (hidden comment: GRM185R61C105KE44D)
C30  ValueDisplayed: 100pF  [0603]  (hidden comment: GRM1885C1H101JA01D)
C32  ValueDisplayed: 100pF  [0603]  (hidden comment: GRM1885C1H101JA01D)
C88  Cap_F: 100nF  [FP-GRM188R72A104KA35J_0603-MFG]  (hidden comment: GRM188R72A104KA35J)
C96  Cap_F: 100nF  [FP-GRM188R72A104KA35J_0603-MFG]  (hidden comment: GRM188R72A104KA35J)
C99  Cap_F: 100nF  [FP-GRM188R72A104KA35J_0603-MFG]  (hidden comment: GRM188R72A104KA35J)
C101  Cap_F: 100nF  [FP-GRM188R72A104KA35J_0603-MFG]  (hidden comment: GRM188R72A104KA35J)
C127  Cap_F: 100nF  [FP-GRM188R72A104KA35J_0603-MFG]  (hidden comment: GRM188R72A104KA35J)
C140  Cap_F: 100nF  [FP-GRM188R72A104KA35J_0603-MFG]  (hidden comment: GRM188R72A104KA35J)
R15  ValueDisplayed: 51.0  [0603]  (hidden comment: RC0603FR-0751RL)
R16  ValueDisplayed: 0  [0603]  (hidden comment: RC0603JR-070RL)
R17  ValueDisplayed: 10.0k  [0603]  (hidden comment: RC0603FR-0710KL)
R18  ValueDisplayed: 0  [0603]  (hidden comment: RC0603JR-070RL)
R19  ValueDisplayed: 2.0k  [0603]  (hidden comment: RC0603JR-072KL)
R20  ValueDisplayed: 2.0k  [0603]  (hidden comment: RC0603JR-072KL)
R21  ValueDisplayed: 51.0  [0603]  (hidden comment: RC0603FR-0751RL)
R22  ValueDisplayed: 2.0k  [0603]  (hidden comment: RC0603JR-072KL)
R23  ValueDisplayed: 2.0k  [0603]  (hidden comment: RC0603JR-072KL)
R24  ValueDisplayed: 10.0k  [0603]  (hidden comment: RC0603FR-0710KL)
R25  ValueDisplayed: 4.70k  [0603]  (hidden comment: RC0603FR-074K7L)
R26  ValueDisplayed: 0  [0603]  (hidden comment: RC0603JR-070RL)
R27  ValueDisplayed: 51.0  [0603]  (hidden comment: RC0603FR-0751RL)
R28  ValueDisplayed: 10.0k  [0603]  (hidden comment: RC0603FR-0710KL)
R29  ValueDisplayed: 0  [0603]  (hidden comment: RC0603JR-070RL)
R30  ValueDisplayed: 2.0k  [0603]  (hidden comment: RC0603JR-072KL)
R31  ValueDisplayed: 2.0k  [0603]  (hidden comment: RC0603JR-072KL)
R32  ValueDisplayed: 51.0  [0603]  (hidden comment: RC0603FR-0751RL)
R33  ValueDisplayed: 2.0k  [0603]  (hidden comment: RC0603JR-072KL)
R34  ValueDisplayed: 2.0k  [0603]  (hidden comment: RC0603JR-072KL)
R35  ValueDisplayed: 10.0k  [0603]  (hidden comment: RC0603FR-0710KL)
U5  XLMG2100R026VBNR  [VBN0018A-MFG]
U6  XLMG2100R026VBNR  [VBN0018A-MFG]

### Ports
FB_FLT (out), POWER, Q1_G (in), Q1_ZVD (out), Q2_G (in), Q2_ZVD (out), Q3_G (in), Q3_ZVD (out), Q4_G (in), Q4_ZVD (out), SW_L1, SW_L2

### Nets
3V3: R25.1
5V: C20.2 C29.2 R16.1 R26.1
GND: C20.1 C21.2 C23.2 C24.1 C29.1 C30.2 C32.2 R17.1 R22.2 R23.2 R24.1 R28.1 R33.2 R34.2 R35.1 U5.15(AGND) U6.15(AGND)
PGND: C88.1 C96.1 C99.1 C101.1 C127.1 C140.1 U5.6(PGND) U5.17(PGND) U5.18(PGND) U6.6(PGND) U6.17(PGND) U6.18(PGND)
~{FAULT}: C24.2 R25.2 U5.16(EN/FLT) U6.16(EN/FLT) ; port FB_FLT
LEG1_HS: C7.2 R19.2 R20.2 U5.11(HS)
LEG2_HS: C18.2 R30.2 R31.2 U6.11(HS)
POWER: C88.2 C96.2 C99.2 C101.2 C127.2 C140.2 U5.7(VIN) U6.7(VIN) ; port POWER  [project net DAB_POWER]
Q1_G: R15.1 R17.2 ; port Q1_G
Q1_ZVD: U5.2(DLH/ZVDH) ; port Q1_ZVD
Q2_G: R21.1 R24.2 ; port Q2_G
Q2_ZVD: U5.1(DHL/ZVDL) ; port Q2_ZVD
Q3_G: R27.1 R28.2 ; port Q3_G
Q3_ZVD: U6.2(DLH/ZVDH) ; port Q3_ZVD
Q4_G: R32.1 R35.2 ; port Q4_G
Q4_ZVD: U6.1(DHL/ZVDL) ; port Q4_ZVD
SW_L1: U5.5(SW) ; port SW_L1
SW_L2: U6.5(SW) ; port SW_L2
NetC7_1: C7.1 R18.1
NetC18_1: C18.1 R29.1
NetC21_1: C21.1 R15.2 U5.12(ENIN/HI)
NetC23_1: C23.1 R21.2 U5.13(PWM/LI)
NetC30_1: C30.1 R27.2 U6.12(ENIN/HI)
NetC32_1: C32.1 R32.2 U6.13(PWM/LI)
NetR16_2: R16.2 U5.14(VCC)
NetR18_2: R18.2 U5.10(HB)
NetR19_1: R19.1 U5.9(RDHR)
NetR20_1: R20.1 U5.8(RDHF)
NetR22_1: R22.1 U5.3(RDLR)
NetR23_1: R23.1 U5.4(RDLF)
NetR26_2: R26.2 U6.14(VCC)
NetR29_2: R29.2 U6.10(HB)
NetR30_1: R30.1 U6.9(RDHR)
NetR31_1: R31.1 U6.8(RDHF)
NetR33_1: R33.1 U6.3(RDLR)
NetR34_1: R34.1 U6.4(RDLF)

### Layout directives
net class MidV1: LEG1_HS, SW_L1
net class MidV2: LEG2_HS, SW_L2
net class LV: 3V3, 5V, GND, LEG1_HS, LEG2_HS, PGND, POWER, SW_L1, SW_L2, ~{FAULT}

### Notes on the sheet
- Drawn By:
- SVN Rev:
- Number:
- TID #:
- Orderable:
- Rev:
- Sheet Title:
- File:
- Project Title:
- Designed for:
- Assembly Variant:
- Mod. Date:
- Sheet:
- Size:
- of
- B
- http://www.ti.com
- Texas Instruments and/or its licensors do not warrant the accuracy or completeness of this specification or any information contained therein. Texas Instruments and/or its licensors do not warrant that this design will meet the specifications, will be suitable for your application or fit for any particular purpose, or will operate in an implementation. Texas Instruments and/or its licensors do not warrant that the design is production worthy. You should completely validate and test your design implementation to confirm the system functionality for your application.
- Engineer:
- Contact:
- © Texas Instruments

### Library data of the parts
C7 C18 = CMP-0007077-5: as C2-C5 on sheet TIDA-010954-ACSwitch; Supplier Part Number 2: 79Y4100; Publisher: Texas Instruments; Supplier 2: Newark; Supplier Part Number 3: 810-CGA3E2X7R1E104K; TempCo: X7R; Supplier 3: Mouser; Published: 2008-06-19; RoHS: Y; MountType: SMT; Supplier 1: Digi-Key; PackageReference: 0603; Tolerance_%: 10%; Cap_Case: 0603; CompType: Capacitor; LatestRevisionDate: 2017-03-09; PartNumber: CGA3E2X7R1E104K080AA; VDC_V: 25V; ComponentLink1Description: Datasheet link; AEC Grade: 1; Supplier Part Number 1: 445-5667-1-ND; Technology: Ceramic; ValueDisplayed: 0.1uF; ComponentLink1URL: https://product.tdk.com/info/en/documents/chara_sheet/CGA3E2X7R1E104K080AA.pdf
C20 C29 = CMP-0007157-5: CAP, CERM, 1 uF, 16 V, +/- 10%, X5R, 0603; Manufacturer: MuRata; TaMin_C: -55°C; Polarized: N; SizeAreaWB_mm2: 4.68; Value1: Unknown; U/M: EA; Value: 1uF; TaMax_C: 85°C; SizeZ_mm: 1; SizeX_mm: 1.6; SizeY_mm: 0.8; SizeArea_mm2: 1.28; Cap_F: 1µF; AEC Category: Q200; Supplier Part Number 2: 81-GRM185R61C105KE44; Publisher: Texas Instruments; Supplier 2: Mouser; Supplier Part Number 3: 1845733; TempCo: X5R; Supplier 3: Farnell; Published: 2008-06-19; RoHS: Y; MountType: SMT; Supplier 1: Digi-Key; PackageReference: 0603; Tolerance_%: 10%; Cap_Case: 0603; Value2: 16V; CompType: Capacitor; LatestRevisionDate: 2017-03-09; PartNumber: GRM185R61C105KE44D; AEC Qualified: ?; ComponentLink1Description: Datasheet link; Supplier Part Number 1: 490-3894-1-ND; Technology: Ceramic; ComponentLink1URL: http://search.murata.co.jp/Ceramy/PnsearchViewAction.do?HnOFG=ON&HnNFG=ON&SEL_CNT=50&sLang=en&sKey=GRM185R61C105KE44D&x=9&y=9&search=startwith
C21 C23 C30 C32 = CMP-0007171-4: as C6 on sheet TIDA-010954-ACSwitch; Supplier Part Number 2: 81-GRM39C101J50; Publisher: Texas Instruments; Supplier 2: Mouser; Supplier Part Number 3: 8819866; TempCo: C0G/NP0; Supplier 3: Farnell; Published: 2008-06-19; RoHS: Y; MountType: SMT; Supplier 1: Digi-Key; PackageReference: 0603; Tolerance_%: 5%; Cap_Case: 0603; CompType: Capacitor; LatestRevisionDate: 2017-03-09; PartNumber: GRM1885C1H101JA01D; AEC Qualified: ?; Cap_F: 100pF; VDC_V: 50V; ComponentLink1Description: Datasheet link; Supplier Part Number 1: 490-1427-1-ND; Technology: Ceramic; ComponentLink1URL: http://search.murata.co.jp/Ceramy/PnsearchViewAction.do?HnOFG=ON&HnNFG=ON&SEL_CNT=50&sLang=en&sKey=GRM1885C1H101JA01D&x=9&y=9&search=startwith
C24 = CMP-0007196-4: CAP, CERM, 22 pF, 50 V, +/- 5%, C0G/NP0, 0603; Manufacturer: MuRata; TaMin_C: -55°C; Polarized: N; SizeAreaWB_mm2: 4.68; Value1: Unknown; U/M: EA; Value: 22pF; TaMax_C: 125°C; SizeZ_mm: 1; SizeX_mm: 1.6; SizeY_mm: 0.8; Value2: 50V; SizeArea_mm2: 1.28; AEC Category: Q200; Supplier Part Number 2: 81-GRM39C220J50; Publisher: Texas Instruments; Supplier 2: Mouser; Supplier Part Number 3: 8819831; TempCo: C0G/NP0; Supplier 3: Farnell; Published: 2008-06-19; RoHS: Y; MountType: SMT; Supplier 1: Digi-Key; PackageReference: 0603; Tolerance_%: 5%; Cap_Case: 0603; CompType: Capacitor; LatestRevisionDate: 2017-03-09; PartNumber: GRM1885C1H220JA01D; AEC Qualified: ?; Cap_F: 22pF; VDC_V: 50V; ComponentLink1Description: Datasheet link; Supplier Part Number 1: 490-1411-1-ND; Technology: Ceramic; ComponentLink1URL: http://search.murata.co.jp/Ceramy/PnsearchViewAction.do?HnOFG=ON&HnNFG=ON&SEL_CNT=50&sLang=en&sKey=GRM1885C1H220JA01D&x=9&y=9&search=startwith
C88 C96 C99 C101 C127 C140 = CMP-0122713-1: Chip Multilayer Ceramic Capacitors for General Purpose, 0603, 0.10uF, X7R, 15%, 10%, 100V; Manufacturer: Murata; AEC Qualified: No; SizeZ_mm: 0.9mm; Value: 100nF; PackageReference: 0603; PartNumber: GRM188R72A104KA35J; RoHS: TRUE; TempCo: 15%; Tolerance_%: 10%; ValueDisplayed: 0.10uF; VDC_V: 100V; Part Number: GRM188R72A104KA35J; datasheet: https://www.murata.com/en-us/products/productdetail?partno=GRM188R72A104KA35%23; Datasheet Path: datasheets/Cap-GRM188R72A104KA35J.pdf; helpURL: https://upverter.com/upn/revision/71520f38ae33ed89/; Lead Free: Yes; Operating Temperature Range: -55°C to +125°C; Temperature Characteristic: X7R; ComponentLink1Description: Datasheet; ComponentLink1URL: https://www.murata.com/en-us/products/productdetail?partno=GRM188R72A104KA35%23
R15 R21 R27 R32 = CMP-0023169-5: as R4 on sheet TIDA-010954-ACSwitch; Supplier Part Number 2: 603-RC0603FR-0751RL; Supplier 2: Mouser; Supplier Part Number 3: 1799350; Supplier 3: Farnell; RoHS: Y; Value1: 1%; Supplier 1: Digi-Key; PackageReference: 0603; Tolerance_%: 1%; CompType: Resistor; PartNumber: RC0603FR-0751RL; ComponentLink1Description: Datasheet link; Supplier Part Number 1: 311-51.0HRCT-ND; Technology: Thick Film; MountType: SMT; ComponentLink1URL: http://www.yageo.com/pdf/Pu-RC0603_51_PbFree_L_2.pdf; AEC Grade: N/A
R16 R18 R26 R29 = CMP-0025885-5: RES, 0, 5%, 0.1 W, 0603; Manufacturer: Yageo; Power_W: 100mW; TempCo: 200 ppm/C; Value_Code: 0000; Value: 0; EIA_Code: E24; SizeX_mm: 1.6; SizeZ_mm: 1; Value2: 0.1W; SizeArea_mm2: 1.28; AEC Qualified: N; VDC_V: 75V; AEC Category: Q200; SizeY_mm: 0.8; SizeAreaWB_mm2: 4.68; Supplier Part Number 2: 603-RC0603JR-070RL; Supplier 2: Mouser; Supplier Part Number 3: 9233130; Supplier 3: Farnell; RoHS: Y; Value1: 5%; MountType: SMT; Supplier 1: Digi-Key; PackageReference: 0603; Tolerance_%: 5%; Res_ohm: 0; CompType: Resistor; PartNumber: RC0603JR-070RL; ComponentLink1Description: Datasheet link; Supplier Part Number 1: 311-0.0GRCT-ND; Technology: Thick Film; ComponentLink1URL: http://www.yageo.com/pdf/Pu-RC0603_51_PbFree_L_2.pdf; AEC Grade: N/A
R17 R24 R28 R35 = CMP-0022746-5: as R5 on sheet TIDA-010954-ACSwitch; Supplier Part Number 2: 603-RC0603FR-0710KL; Supplier 2: Mouser; Supplier Part Number 3: 9238603; Supplier 3: Farnell; RoHS: Y; Value1: 1%; MountType: SMT; Supplier 1: Digi-Key; PackageReference: 0603; Tolerance_%: 1%; CompType: Resistor; PartNumber: RC0603FR-0710KL; ComponentLink1Description: Datasheet link; Supplier Part Number 1: 311-10.0KHRCT-ND; Technology: Thick Film; ComponentLink1URL: http://www.yageo.com/pdf/Pu-RC0603_51_PbFree_L_2.pdf; AEC Grade: N/A
R19 R20 R22 R23 R30 R31 R33 R34 = CMP-0025909-5: RES, 2.0 k, 5%, 0.1 W, 0603; Manufacturer: Yageo; Power_W: 100mW; TempCo: 100 ppm/C; Value_Code: 2k00; Value: 2.0k; EIA_Code: E24; Res_ohm: 2k; SizeX_mm: 1.6; SizeY_mm: 0.8; SizeZ_mm: 1; Value2: 0.1W; SizeArea_mm2: 1.28; AEC Qualified: N; VDC_V: 75V; AEC Category: Q200; SizeAreaWB_mm2: 4.68; Supplier Part Number 2: 603-RC0603JR-072KL; Supplier 2: Mouser; Supplier Part Number 3: 1799398; Supplier 3: Farnell; RoHS: Y; Value1: 5%; MountType: SMT; Supplier 1: Digi-Key; PackageReference: 0603; Tolerance_%: 5%; CompType: Resistor; PartNumber: RC0603JR-072KL; ComponentLink1Description: Datasheet link; Supplier Part Number 1: 311-2.0KGRCT-ND; Technology: Thick Film; ComponentLink1URL: http://www.yageo.com/pdf/Pu-RC0603_51_PbFree_L_2.pdf; AEC Grade: N/A
R25 = CMP-0023153-5: RES, 4.70 k, 1%, 0.1 W, 0603; Manufacturer: Yageo; Power_W: 100mW; TempCo: 100 ppm/C; Value_Code: 4k70; Value: 4.70k; Res_ohm: 4.7k; SizeX_mm: 1.6; SizeY_mm: 0.8; SizeZ_mm: 1; Value2: 0.1W; SizeArea_mm2: 1.28; AEC Qualified: N; VDC_V: 75V; AEC Category: Q200; SizeAreaWB_mm2: 4.68; Supplier Part Number 2: 603-RC0603FR-074K7L; Supplier 2: Mouser; Supplier Part Number 3: 9238565; Supplier 3: Farnell; RoHS: Y; Value1: 1%; MountType: SMT; Supplier 1: Digi-Key; PackageReference: 0603; Tolerance_%: 1%; CompType: Resistor; PartNumber: RC0603FR-074K7L; ComponentLink1Description: Datasheet link; Supplier Part Number 1: 311-4.70KHRCT-ND; Technology: Thick Film; ComponentLink1URL: http://www.yageo.com/pdf/Pu-RC0603_51_PbFree_L_2.pdf; AEC Grade: N/A
U5 U6 = CMP-0122483-1: 170-V GaN Half-Bridge Power Stages; Manufacturer: Texas Instruments; Part Number: LMG2175; SizeZ_mm: 0.85mm; AEC Qualified: No; Max Supply Voltage: 5.5V; Min Supply Voltage: 4.5V; Nominal Supply Current: 8.5mA; Number Of Outputs: 1; Standoff Height: 0mm; TJmax_C: +150°C; PackageReference: VQFN-FCRLF18; PartNumber: XLMG2100R026VBNR; RoHS: UNKNOWN; Operating Temperature Range: -40°C to +150°C; Datasheet Path: datasheets/IC-LMG2175.pdf; helpURL: https://upverter.com/upn/revision/effccdb2183bc5a0/